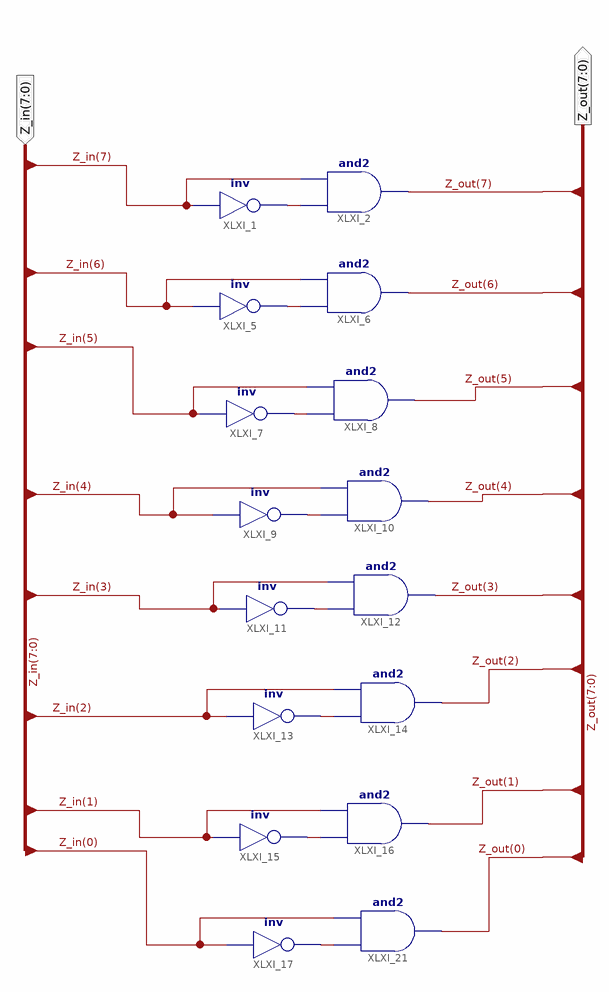
[diagram p0: schematic sheet 1]
// Xilinx ISE schematic zero.sch (spartan3e) as structural Verilog: 16 symbols, 2 ports
module zero (
  input  [7:0] Z_in,
  output [7:0] Z_out
);

  wire XLXN_1, XLXN_3, XLXN_4, XLXN_5, XLXN_6, XLXN_7, XLXN_8, XLXN_9;

  not XLXI_1 (XLXN_1, Z_in[7]);
  and XLXI_2 (Z_out[7], XLXN_1, Z_in[7]);
  not XLXI_5 (XLXN_3, Z_in[6]);
  and XLXI_6 (Z_out[6], XLXN_3, Z_in[6]);
  not XLXI_7 (XLXN_4, Z_in[5]);
  and XLXI_8 (Z_out[5], XLXN_4, Z_in[5]);
  not XLXI_9 (XLXN_5, Z_in[4]);
  and XLXI_10 (Z_out[4], XLXN_5, Z_in[4]);
  not XLXI_11 (XLXN_6, Z_in[3]);
  and XLXI_12 (Z_out[3], XLXN_6, Z_in[3]);
  not XLXI_13 (XLXN_7, Z_in[2]);
  and XLXI_14 (Z_out[2], XLXN_7, Z_in[2]);
  not XLXI_15 (XLXN_8, Z_in[1]);
  and XLXI_16 (Z_out[1], XLXN_8, Z_in[1]);
  not XLXI_17 (XLXN_9, Z_in[0]);
  and XLXI_21 (Z_out[0], XLXN_9, Z_in[0]);
endmodule
